# EasyEDA Pro project stm32f401rct6v2.eprj, board STM32F401RCT6V2W5500
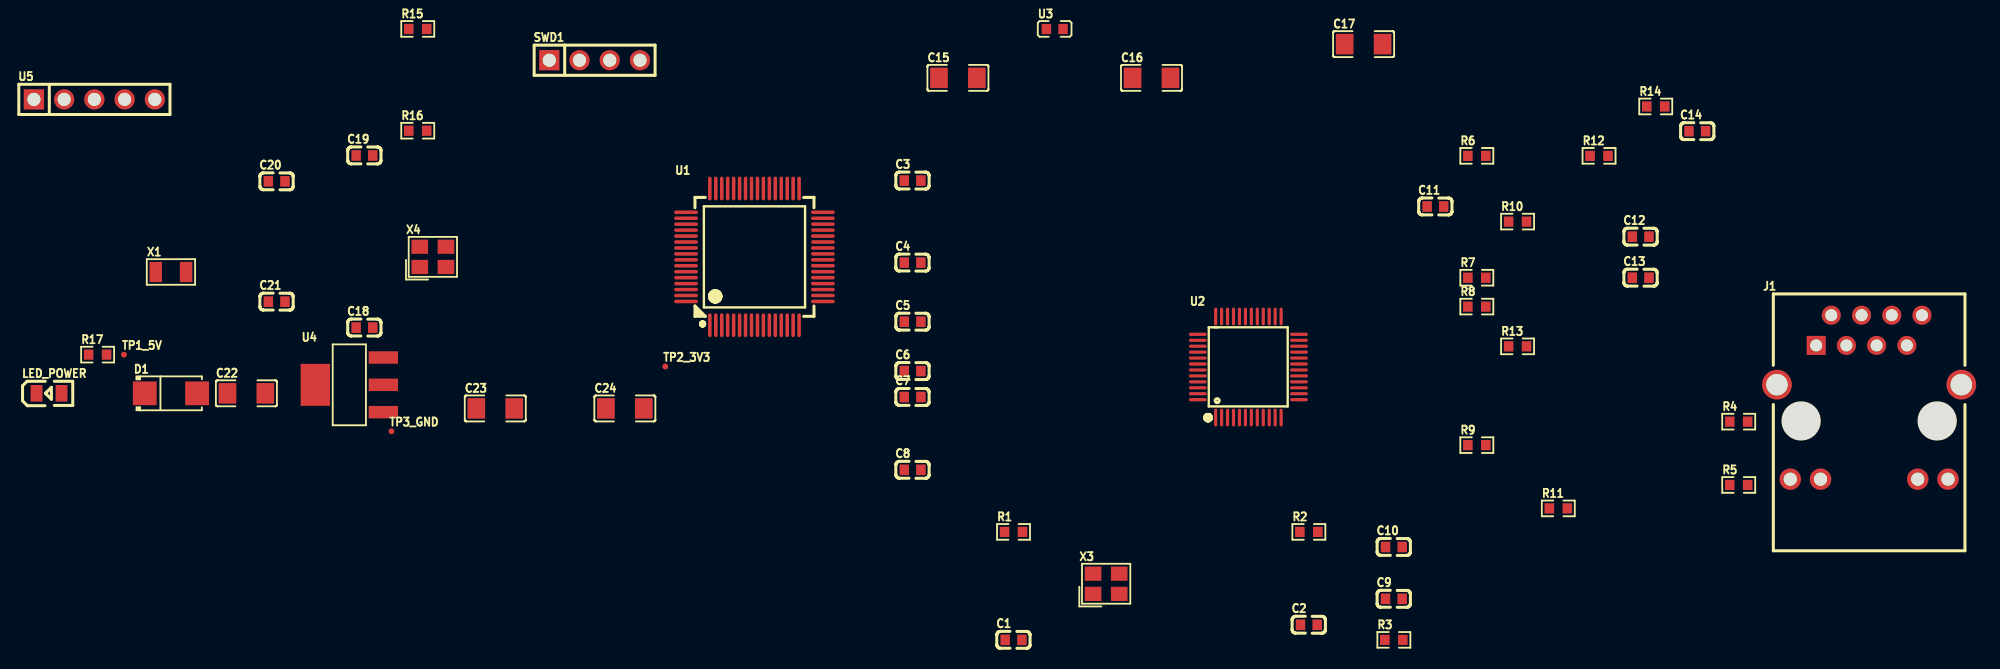
[diagram p6: board, top side]
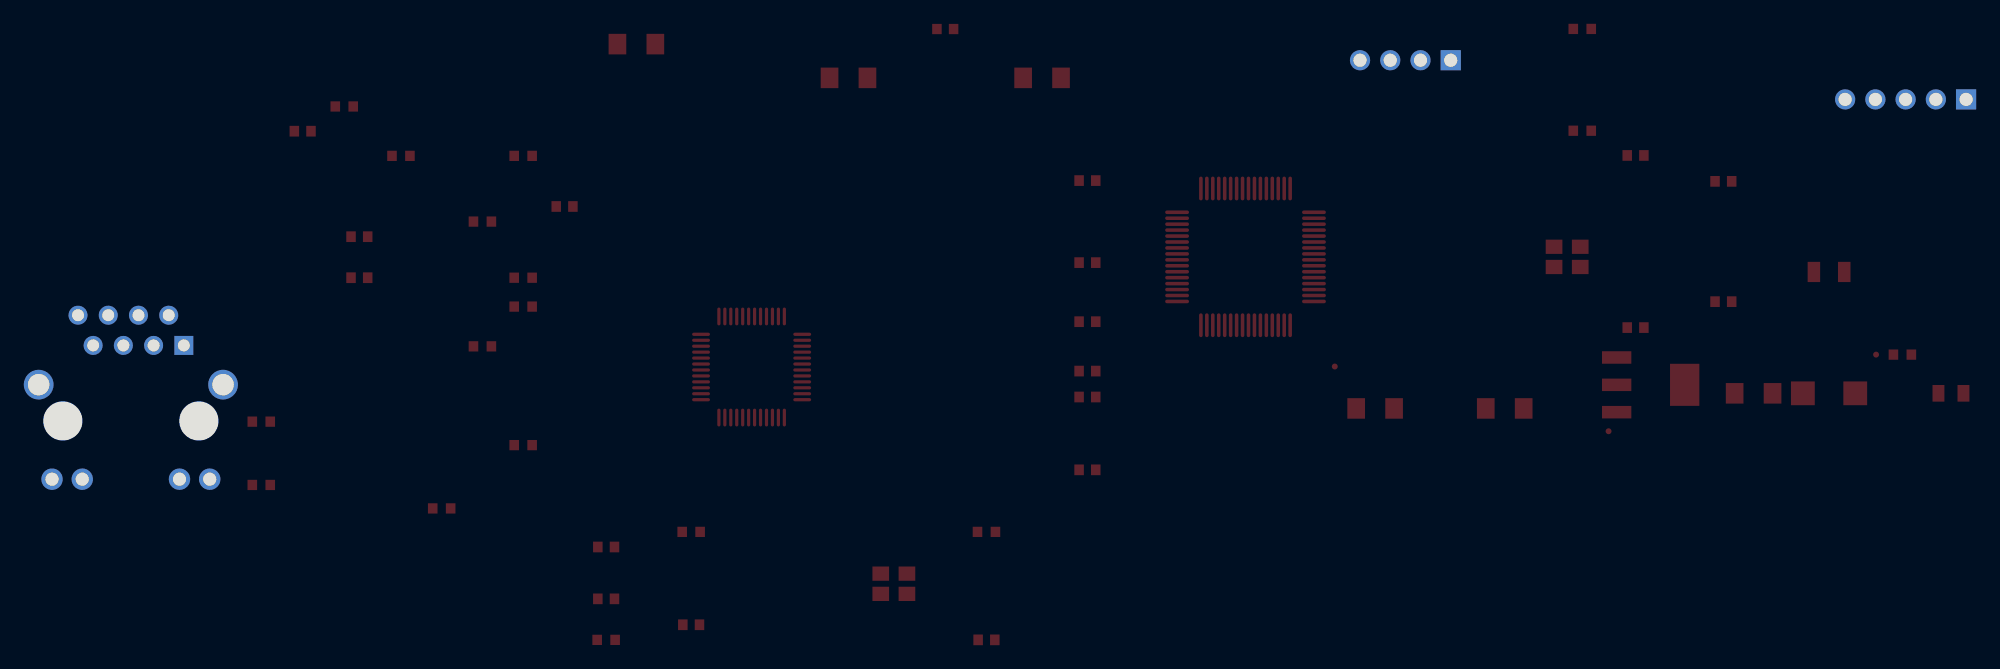
[diagram p7: board, bottom side, seen from below]

Outline 14.72 x 3.29 mm; copper layers: Top Layer, Bottom Layer. Coordinates in mm from the lower left corner of the outline.
Stack: Top Layer 0.035mm / Dielectric1 1.51mm FR4 er 4.5 / Bottom Layer 0.035mm

## Design rules (mm)
template: JLCPCB Capability(Two Layers Board)
spacing copperThickness1oz (default): track to track 0.102, other pairs 0.152 to 0.3
spacing copperThickness2oz: track to track 0.203, other pairs 0.152 to 0.3
track width copperThickness1oz (default): min 0.127, default 0.254, max 2.54
track width copperThickness2oz: min 0.203, default 0.254, max 2.54
differential pair differentialPair (default): width min 0.127, default 0.254, max 2.54; gap min 0.152, default 0.152
via viaSize (default): diameter min 0.5, default 0.61, max 10; hole min 0.3, default 0.305, max 6.3

## Placement (name value [footprint] x y rotation side)
C1  18pF  [C0603]  -64.53 -16.77 0 top
C2  18pF  [C0603]  -39.71 -15.5 0 top
C3  100nF  [C0603]  -73.01 21.86 0 top
C4  100nF  [C0603]  -73.01 14.96 0 top
C5  100nF  [C0603]  -73.01 9.99 0 top
C6  100nF  [C0603]  -73.01 5.84 0 top
C7  100nF  [C0603]  -73.01 3.66 0 top
C8  100nF  [C0603]  -73.01 -2.47 0 top
C9  4.7uF  [C0603]  -32.57 -13.32 0 top
C10  10nF  [C0603]  -32.57 -8.96 0 top
C11  10nF  [C0603]  -29.08 19.68 0 top
C12  6.8nF  [C0603]  -11.84 17.14 0 top
C13  6.8nF  [C0603]  -11.84 13.69 0 top
C14  22nF  [C0603]  -7.08 26.01 0 top
C15  10uF  [C1206]  -69.2 30.5 0 top
C16  10uF  [C1206]  -52.93 30.5 0 top
C17  1nF  [C1206]  -35.11 33.33 0 top
C18  22pF  [C0603]  -119.06 9.5 0 top
C19  22pF  [C0603]  -119.06 23.97 0 top
C20  6pF  [C0603]  -126.44 21.79 0 top
C21  6pF  [C0603]  -126.44 11.67 0 top
C22  47uF  [C1206]  -128.98 3.97 0 top
C23  47uF  [C1206]  -108.07 2.7 0 top
C24  100nF  [C1206]  -97.18 2.7 0 top
D1  SMAJ5.0A  [SMA_L4.3-W2.6-LS5.2-RD]  -135.32 3.97 0 top
J1  HR911105A  [RJ45-TH_HR911105A]  7.36 3.64 0 top
LED_POWER  NCD0805R1  [LED0805-R-RD]  -145.56 3.97 0 top
R1  1MΩ  [R0603]  -64.53 -7.69 0 top
R2  0Ω  [R0603]  -39.71 -7.69 0 top
R3  12.4kΩ  [R0603]  -32.57 -16.77 0 top
R4  330Ω  [R0603]  -3.6 1.58 0 top
R5  330Ω  [R0603]  -3.6 -3.74 0 top
R6  0Ω  [R0603]  -25.6 23.94 0 top
R7  0Ω  [R0603]  -25.6 13.69 0 top
R8  0Ω  [R0603]  -25.6 11.26 0 top
R9  0Ω  [R0603]  -25.6 -0.39 0 top
R10  49.9Ω  [R0603]  -22.18 18.41 0 top
R11  49.9Ω  [R0603]  -18.76 -5.71 0 top
R12  49.9Ω  [R0603]  -15.33 23.94 0 top
R13  49.9Ω  [R0603]  -22.18 7.92 0 top
R14  10Ω  [R0603]  -10.57 28.09 0 top
R15  10kΩ  [R0603]  -114.58 34.61 0 top
R16  10kΩ  [R0603]  -114.58 26.05 0 top
R17  1kΩ  [R0603]  -141.48 7.22 0 top
SWD1  PZ254V-11-04P  [HDR-TH_4P-P2.54-V-M]  -99.72 31.98 0 top
TP1_5V  -  [Test-Point-0.5mm]  -139.27 7.22 0 top
TP2_3V3  -  [Test-Point-0.5mm]  -93.79 6.22 0 top
TP3_GND  -  [Test-Point-0.5mm]  -116.79 0.78 0 top
U1  STM32F401RCT6  [LQFP-64_L10.0-W10.0-P0.50-LS12.0-BL]  -86.29 15.44 0 top
U2  W5500  [LQFP-48_L7.0-W7.0-P0.50-LS9.0-BL]  -44.79 6.18 0 top
U3  BLM18PG121SN1D  [L0603]  -61.06 34.6 0 top
U4  AMS1117-3.3  [SOT-223_L6.5-W3.5-P2.30-LS7.0-BR]  -120.33 4.68 0 top
U5  HB-PH3-25415PB2GOP  [HDR-TH_5P-P2.54-V-M]  -141.75 28.68 0 top
X1  32.768kHz  [OSC-SMD_L3.2-W1.5]  -135.32 14.17 0 top
X3  25MHz  [CRYSTAL-SMD_4P-L3.2-W2.5-BL]  -56.74 -12.05 0 top
X4  25MHz  [CRYSTAL-SMD_4P-L3.2-W2.5-BL]  -113.31 15.44 0 top

## Footprints (pads in the part's own frame, mm; a bottom-side part is the same pattern mirrored in y, then rotated)
C0603
  rect 0.8x0.9 smd: 1(-0.7,0) 2(0.7,0)
C1206
  rect 1.485x1.728 smd: 1(-1.593,0) 2(1.593,0)
CRYSTAL-SMD_4P-L3.2-W2.5-BL
  rect 1.4x1.2 smd: 1(-1.1,-0.85) 2(1.1,-0.85) 3(1.1,0.85) 4(-1.1,0.85)
HDR-TH_4P-P2.54-V-M
  rect 1.7x1.7 hole 1.1: 1(-3.81,0)
  round 1.7 hole 1.1: 2(-1.27,0) 3(1.27,0) 4(3.81,0)
HDR-TH_5P-P2.54-V-M
  rect 1.7x1.7 hole 1.1: 1(-5.08,0)
  round 1.7 hole 1.1: 2(-2.54,0) 3(0,0) 4(2.54,0) 5(5.08,0)
L0603
  rect 0.8x0.864 smd: 1(-0.7,0) 2(0.7,0)
LED0805-R-RD
  rect 1x1.399 smd: 1(1.05,0) 2(-1.05,0)
LQFP-48_L7.0-W7.0-P0.50-LS9.0-BL
  oval 0.27x1.5 smd: 1(-2.75,-4.25) 2(-2.25,-4.25) 3(-1.75,-4.25) 4(-1.25,-4.25) 5(-0.75,-4.25) 6(-0.25,-4.25) 7(0.25,-4.25) 8(0.75,-4.25) 9(1.25,-4.25) 10(1.75,-4.25) 11(2.25,-4.25) 12(2.75,-4.25) 25(2.75,4.25) 26(2.25,4.25) 27(1.75,4.25) 28(1.25,4.25) 29(0.75,4.25) 30(0.25,4.25) 31(-0.25,4.25) 32(-0.75,4.25) 33(-1.25,4.25) 34(-1.75,4.25) 35(-2.25,4.25) 36(-2.75,4.25)
  oval 1.5x0.27 smd: 13(4.25,-2.75) 14(4.25,-2.25) 15(4.25,-1.75) 16(4.25,-1.25) 17(4.25,-0.75) 18(4.25,-0.25) 19(4.25,0.25) 20(4.25,0.75) 21(4.25,1.25) 22(4.25,1.75) 23(4.25,2.25) 24(4.25,2.75) 37(-4.25,2.75) 38(-4.25,2.25) 39(-4.25,1.75) 40(-4.25,1.25) 41(-4.25,0.75) 42(-4.25,0.25) 43(-4.25,-0.25) 44(-4.25,-0.75) 45(-4.25,-1.25) 46(-4.25,-1.75) 47(-4.25,-2.25) 48(-4.25,-2.75)
LQFP-64_L10.0-W10.0-P0.50-LS12.0-BL
  oval 0.3x2 smd: 1(-3.75,-5.75) 2(-3.25,-5.75) 3(-2.75,-5.75) 4(-2.25,-5.75) 5(-1.75,-5.75) 6(-1.25,-5.75) 7(-0.75,-5.75) 8(-0.25,-5.75) 9(0.25,-5.75) 10(0.75,-5.75) 11(1.25,-5.75) 12(1.75,-5.75) 13(2.25,-5.75) 14(2.75,-5.75) 15(3.25,-5.75) 16(3.75,-5.75) 33(3.75,5.75) 34(3.25,5.75) 35(2.75,5.75) 36(2.25,5.75) 37(1.75,5.75) 38(1.25,5.75) 39(0.75,5.75) 40(0.25,5.75) 41(-0.25,5.75) 42(-0.75,5.75) 43(-1.25,5.75) 44(-1.75,5.75) 45(-2.25,5.75) 46(-2.75,5.75) 47(-3.25,5.75) 48(-3.75,5.75)
  oval 2x0.3 smd: 17(5.75,-3.75) 18(5.75,-3.25) 19(5.75,-2.75) 20(5.75,-2.25) 21(5.75,-1.75) 22(5.75,-1.25) 23(5.75,-0.75) 24(5.75,-0.25) 25(5.75,0.25) 26(5.75,0.75) 27(5.75,1.25) 28(5.75,1.75) 29(5.75,2.25) 30(5.75,2.75) 31(5.75,3.25) 32(5.75,3.75) 49(-5.75,3.75) 50(-5.75,3.25) 51(-5.75,2.75) 52(-5.75,2.25) 53(-5.75,1.75) 54(-5.75,1.25) 55(-5.75,0.75) 56(-5.75,0.25) 57(-5.75,-0.25) 58(-5.75,-0.75) 59(-5.75,-1.25) 60(-5.75,-1.75) 61(-5.75,-2.25) 62(-5.75,-2.75) 63(-5.75,-3.25) 64(-5.75,-3.75)
OSC-SMD_L3.2-W1.5
  rect 1.05x1.7 smd: 1(-1.275,0) 2(1.275,0)
R0603
  rect 0.806x0.864 smd: 1(-0.753,0) 2(0.753,0)
RJ45-TH_HR911105A
  rect 1.6x1.6 hole 1: 1(-4.45,4.355)
  round 1.6 hole 1: 2(-3.18,6.895) 3(-1.91,4.355) 4(-0.64,6.895) 5(0.63,4.355) 6(1.9,6.895) 7(3.17,4.355) 8(4.44,6.895)
  round 1.8 hole 1.1: 9(-6.625,-6.895) 10(-4.085,-6.895) 11(4.085,-6.895) 12(6.625,-6.895)
  round 2.5 hole 1.8: SH1(-7.745,1.055) SH2(7.745,1.055)
SMA_L4.3-W2.6-LS5.2-RD
  rect 2x2 smd: 1(-2.2,0) 2(2.2,0)
SOT-223_L6.5-W3.5-P2.30-LS7.0-BR
  rect 2.465x1.05 smd: 1(2.857,-2.3) 2(2.857,0) 3(2.857,2.3)
  rect 2.465x3.54 smd: 4(-2.857,0)
Test-Point-0.5mm
  round 0.5 smd: 1(0,0)

## Nets
As in the schematic, except:
3V3: C16.1 C23.1 C24.1 J1.9 J1.12 R15.1 SWD1.1 TP2_3V3.1 U3.2 U4.2 U4.4 U5.2
OSC32_IN: C20.1 X1.1
OSC32_OUT: C21.1 X1.2
OSC_IN: C19.2 X4.3
OSC_OUT: C18.2 X4.1
STM32_PA13: U1.46
STM32_PA14: U1.49
SWCLK: R16.1 SWD1.3
SWDIO: R15.2 SWD1.2

Pads without a net: J1 7; U1 1 2 7 8 9 10 11 13 14 15 16 17 19 20 21 22 23 24 25 26 27 28 29 30 32 33 34 35 36 37 38 39 40 41 42 43 48 50 51 52 53 54 55 56 57 58 59 60 61 62 64; U2 7 12 13 18 46 47
